# Altium schematic sheet 06.SchDoc
size 513 x 386 mm
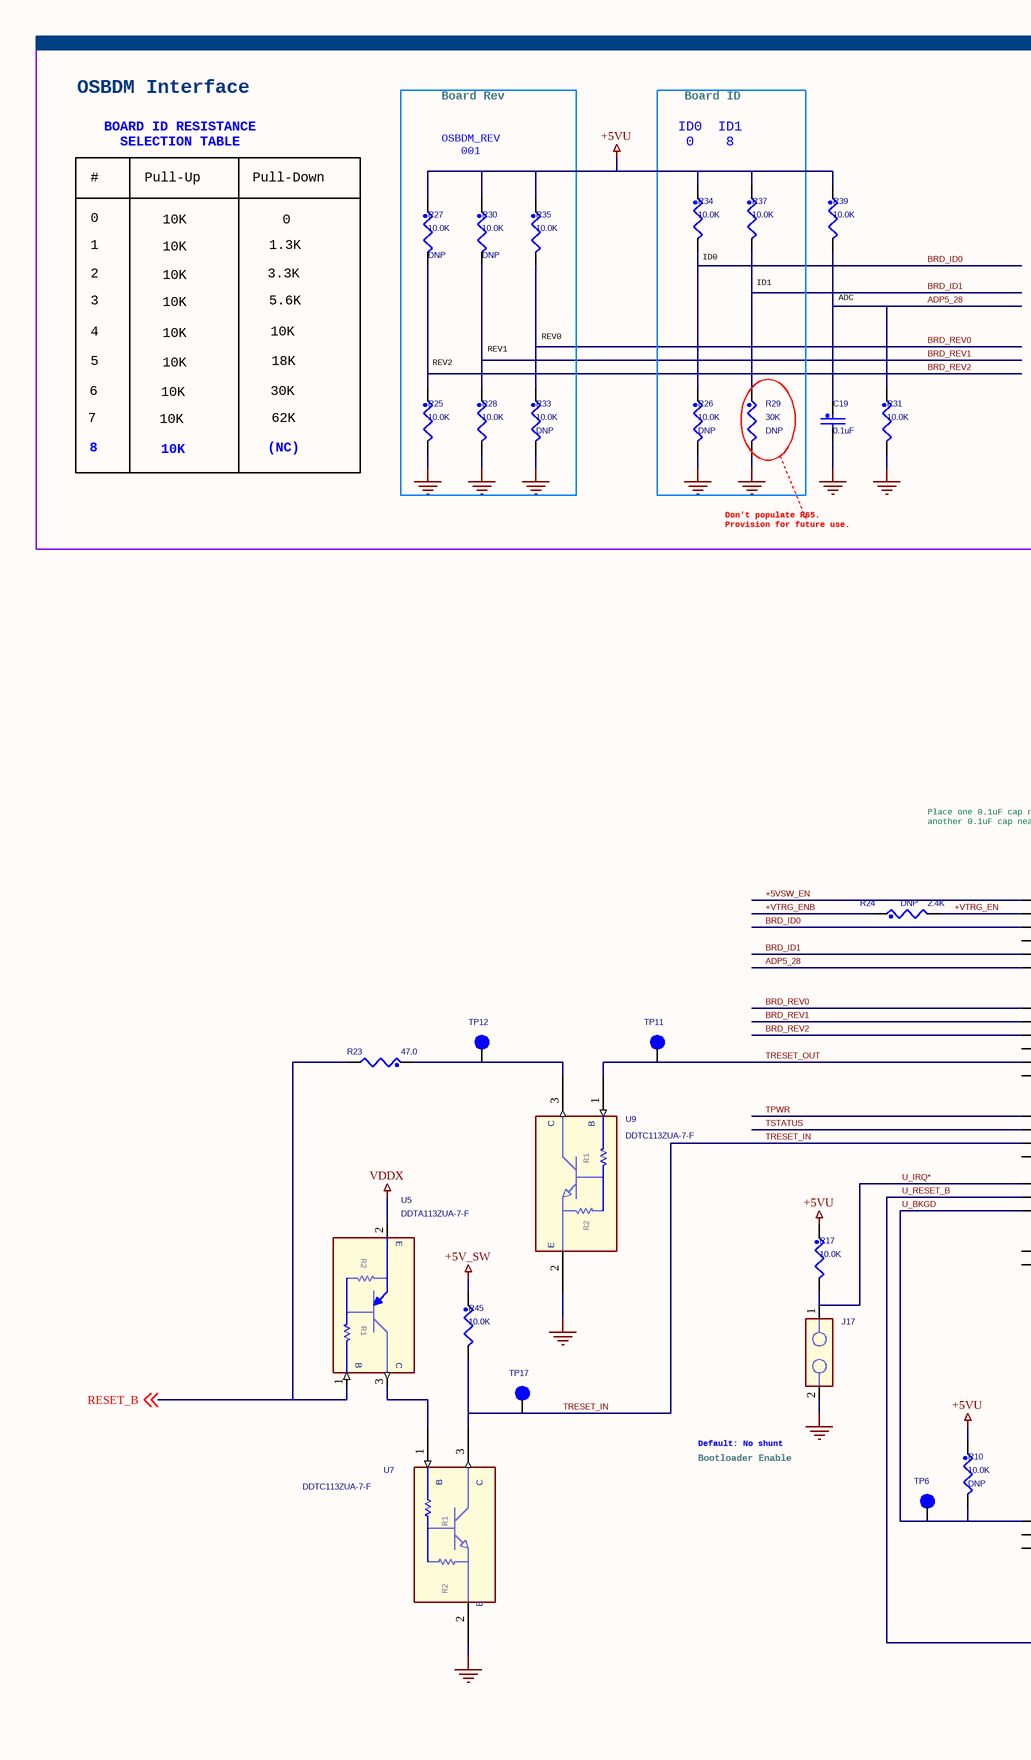
[diagram p0: 06.SchDoc, left]
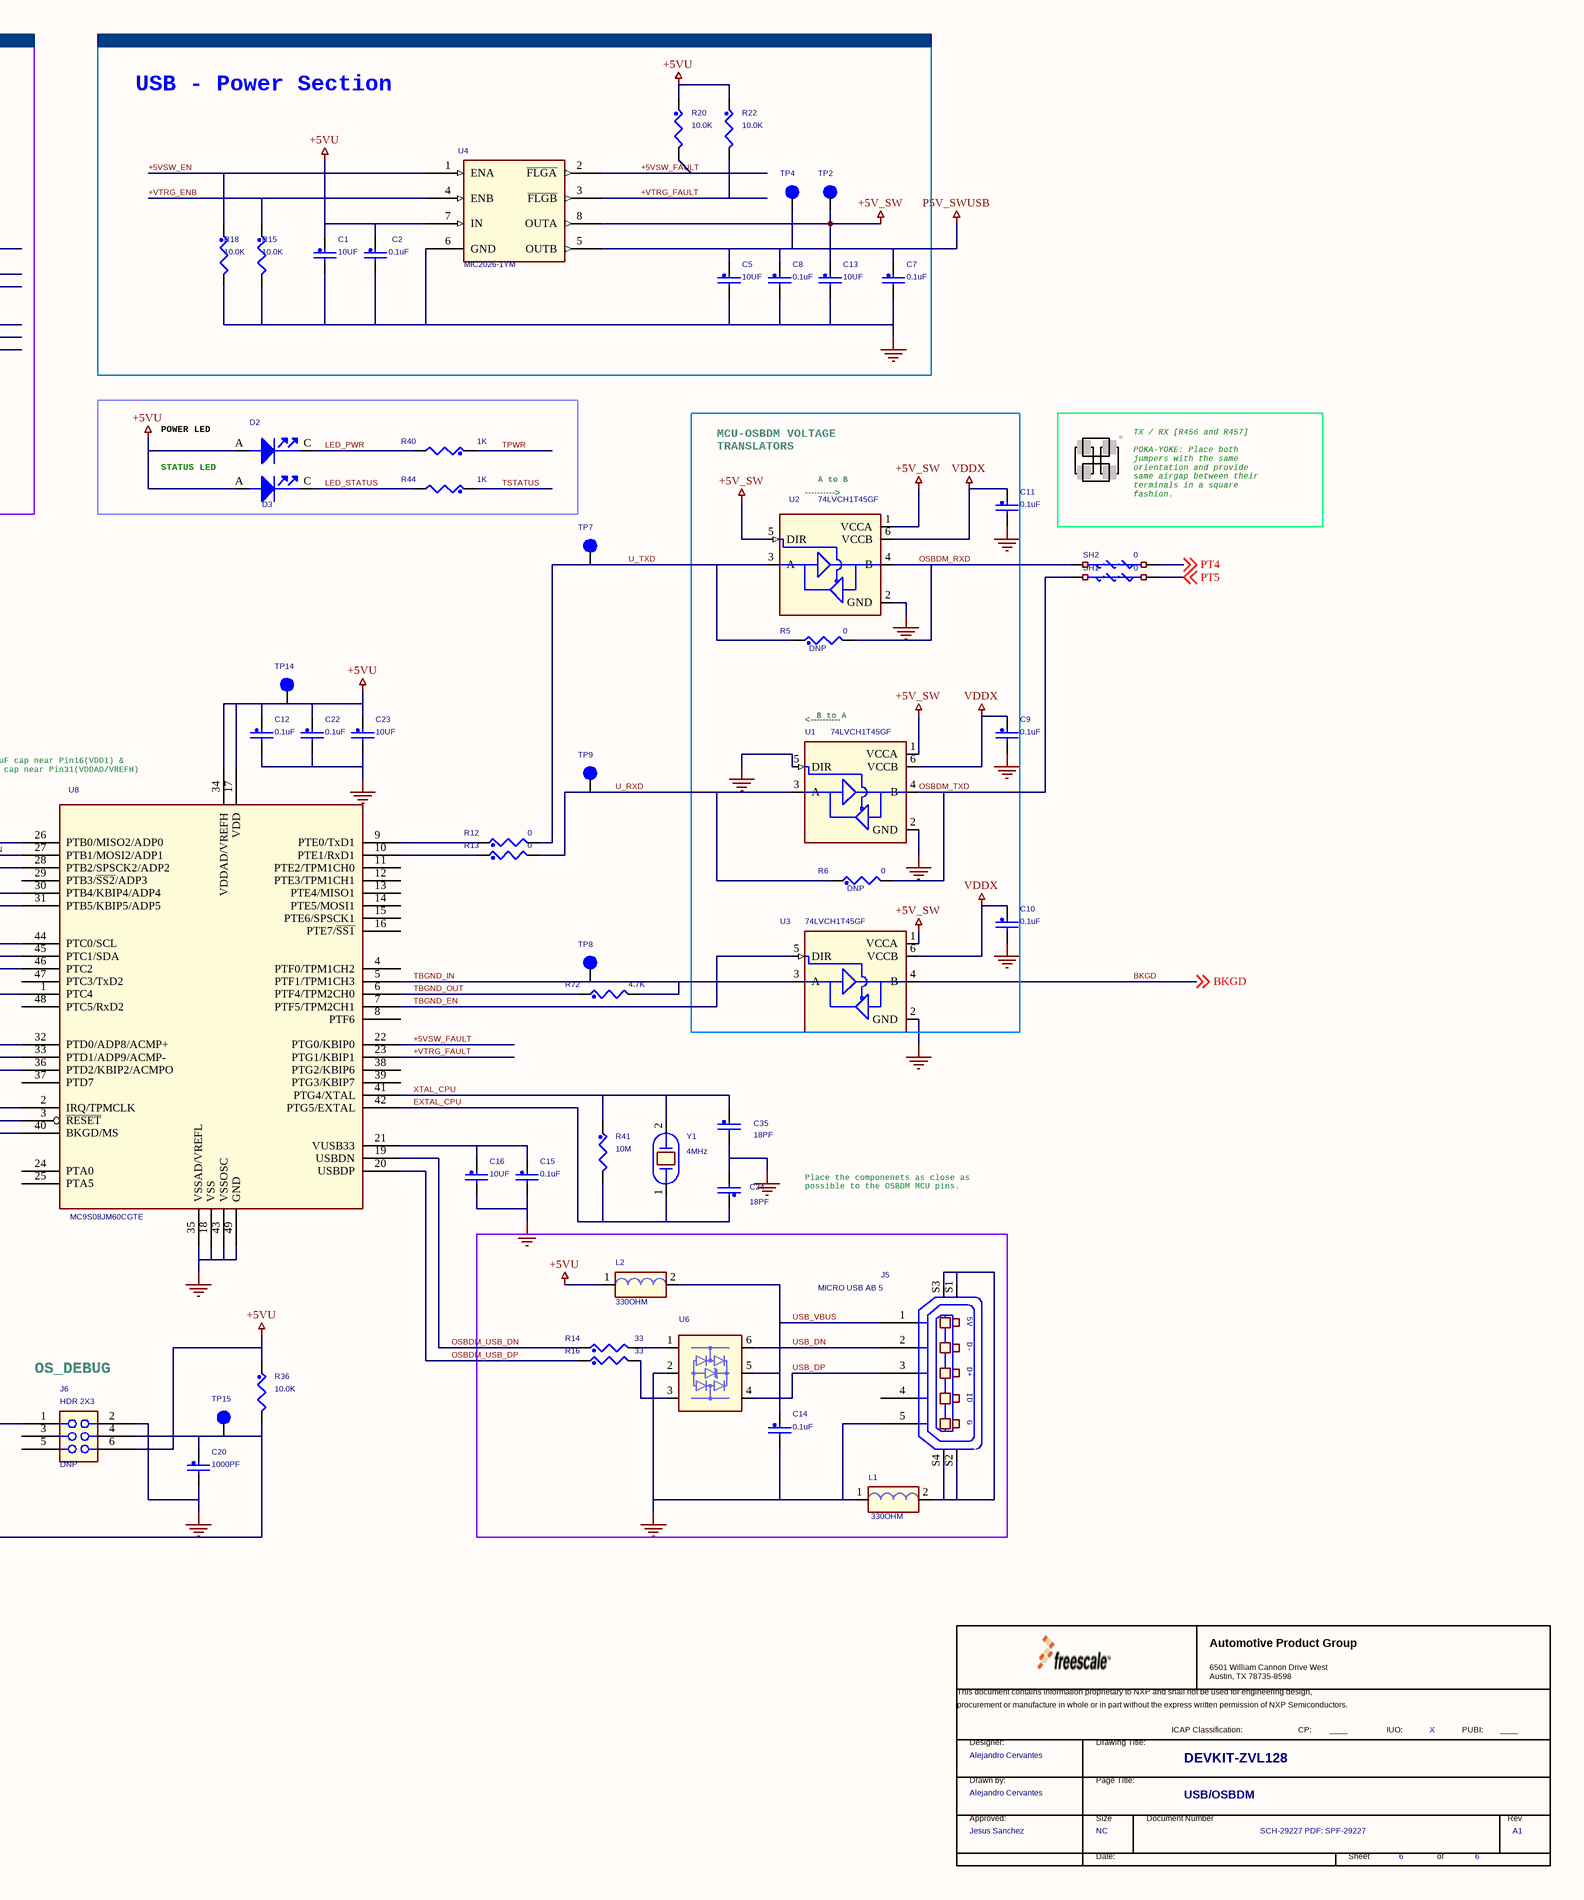
[diagram p1: 06.SchDoc, right]

## Parts
*  FCP: ____  FIUO: X  DrawnBy: Alejandro Cervantes  Approver: Jesus Sanchez  PageTitle: USB/OSBDM  Page Count: 6  Page Size: NC  Title: DEVKIT-ZVL128  RevCode: A1  Doc: SCH-29227 PDF: SPF-29227  (hidden comment: TitleBlock_AMPG)  (graphical)
C1  10UF  [CC0805_OV]
C2  0.1uF  [CC0402_25]
C5  10UF  [CC0805_OV]
C7  0.1uF  [CC0402_25]
C8  0.1uF  [CC0402_25]
C9  0.1uF  [CC0402_25]
C10  0.1uF  [CC0402_25]
C11  0.1uF  [CC0402_25]
C12  0.1uF  [CC0402_25]
C13  10UF  [CC0805_OV]
C14  0.1uF  [CC0402_25]
C15  0.1uF  [CC0402_25]
C16  10UF  [CC0805_OV]
C19  0.1uF  [CC0402_25]
C20  1000PF  [CC0402_25]
C22  0.1uF  [CC0402_25]
C23  10UF  [CC0805_OV]
C24  18PF  [CC0402_25]
C35  18PF  [CC0402_25]
D2  LED_YEL  [LED_0603]  (value not drawn)
D3  LED_GREEN  [LED_0603]  (value not drawn)
J5  MICRO USB AB 5  [con5_microusb]
J6  HDR 2X3  ASSY_OPT: DNP  [HDR203]
J17  HDR 1X2 TH  [HDR102]  (value not drawn)
L1  330OHM  [IND_0805]
L2  330OHM  [IND_0805]
R5  0  ASSY_OPT: DNP  [RC0603_OV]
R6  0  ASSY_OPT: DNP  [RC0603_OV]
R10  10.0K  ASSY_OPT: DNP  [RC0402_25]
R12  0  [RC0603_OV]
R13  0  [RC0603_OV]
R14  33  [RC0603_OV]
R15  10.0K  [RC0402_25]
R16  33  [RC0603_OV]
R17  10.0K  [RC0402_25]
R18  10.0K  [RC0402_25]
R20  10.0K  [RC0402_25]
R22  10.0K  [RC0402_25]
R23  47.0  [RC0603_OV]
R24  2.4K  ASSY_OPT: DNP  [RC0603_OV]
R25  10.0K  [RC0402_25]
R26  10.0K  ASSY_OPT: DNP  [RC0402_25]
R27  10.0K  ASSY_OPT: DNP  [RC0402_25]
R28  10.0K  [RC0402_25]
R29  30K  ASSY_OPT: DNP  [RC0402_25]
R30  10.0K  ASSY_OPT: DNP  [RC0402_25]
R31  10.0K  [RC0402_25]
R33  10.0K  ASSY_OPT: DNP  [RC0402_25]
R34  10.0K  [RC0402_25]
R35  10.0K  [RC0402_25]
R36  10.0K  [RC0402_25]
R37  10.0K  [RC0402_25]
R39  10.0K  [RC0402_25]
R40  1K  [RC0603_OV]
R41  10M  [RC0402_25]
R44  1K  [RC0603_OV]
R45  10.0K  [RC0402_25]
R72  4.7K  [RC0402_25]
SH1  0  [SH0603]
SH2  0  [SH0603]
TP2  TPAD_028  [TPAD_028]  (value not drawn)
TP4  TPAD_028  [TPAD_028]  (value not drawn)
TP6  TPAD_028  [TPAD_028]  (value not drawn)
TP7  TPAD_028  [TPAD_028]  (value not drawn)
TP8  TPAD_028  [TPAD_028]  (value not drawn)
TP9  TPAD_028  [TPAD_028]  (value not drawn)
TP11  TPAD_028  [TPAD_028]  (value not drawn)
TP12  TPAD_028  [TPAD_028]  (value not drawn)
TP14  TPAD_028  [TPAD_028]  (value not drawn)
TP15  TPAD_028  [TPAD_028]  (value not drawn)
TP17  TPAD_028  [TPAD_028]  (value not drawn)
U1  74LVCH1T45GF  [sot891_6p_0p35_1p05x1p05]
U2  74LVCH1T45GF  [sot891_6p_0p35_1p05x1p05]
U3  74LVCH1T45GF  [sot891_6p_0p35_1p05x1p05]
U4  MIC2026-1YM  [SO8]
U5  DDTA113ZUA-7-F  [sc70_3]
U6  RClamp0502A.TCT  [SC-89]  (value not drawn)
U7  DDTC113ZUA-7-F  [sc70_3]
U8  MC9S08JM60CGTE  [qfn48_0p5_5p25x5p25_a]
U9  DDTC113ZUA-7-F  [sc70_3]
Y1  4MHz  [HC49SDLF]

## Blocks framed on the sheet
OSBDM Interface: C19 R31 R39
Board Rev: R25 R27 R28 R30 R33 R35
Board ID: R26 R29 R34 R37
USB - Power Section: C1 C2 C5 C7 C8 C13 R15 R18 R20 R22 TP2 TP4 U4

## Nets
+5V_SW: C13.1 R45.1 TP2.1(Pin1) U1.1(VCCA) U2.1(VCCA) U2.5(DIR) U3.1(VCCA) U4.8(OUTA)
+5VU: C1.1 C2.1 C12.1 C22.1 C23.1 D2.A(ANODE) D3.A(ANODE) J6.6(B3) L2.1 R10.1 R17.1 R20.1 R22.1 R27.1 R30.1 R34.1 R35.1 R36.1 R37.1 R39.1 TP14.1(Pin1) U4.7(IN) U8.17(VDD) U8.34(VDDAD/VREFH)
GND: C1.2 C2.2 C5.2 C7.2 C8.2 C9.2 C10.2 C11.2 C12.2 C13.2 C14.2 C15.2 C16.2 C19.2 C20.2 C22.2 C23.2 C24.2 C35.2 J5.5(P5) J6.2(B1) J17.2 L1.1 R15.2 R18.2 R25.2 R26.2 R28.2 R29.2 R31.2 R33.2 U1.2(GND) U1.5(DIR) U2.2(GND) U3.2(GND) U4.6(GND) U6.2(GND) U7.2(E) U8.18(VSS) U8.35(VSSAD/VREFL) U8.43(VSSOSC) U8.49(GND) U9.2(E)
P5V_SWUSB: C5.1 C7.1 C8.1 TP4.1(Pin1) U4.5(OUTB)
VDDX: C9.1 C10.1 C11.1 U1.6(VCCB) U2.6(VCCB) U3.6(VCCB) U5.2(E)
+5VSW_EN: R18.1 U4.1(ENA) U8.26(PTB0/MISO2/ADP0)
+5VSW_FAULT: R20.2 U4.2(~{FLGA}) U8.22(PTG0/KBIP0)
+VTRG_EN: R24.2 U8.27(PTB1/MOSI2/ADP1)
+VTRG_ENB: R15.1 R24.1 U4.4(ENB)
+VTRG_FAULT: R22.2 U4.3(~{FLGB}) U8.23(PTG1/KBIP1)
ADP5_28: C19.1 R31.1 R39.2 U8.31(PTB5/KBIP5/ADP5)
BKGD: U3.4(B) ; off-sheet BKGD
BRD_ID0: R26.1 R34.2 U8.28(PTB2/SPSCK2/ADP2)
BRD_ID1: R29.1 R37.2 U8.30(PTB4/KBIP4/ADP4)
BRD_REV0: R33.1 R35.2 U8.44(PTC0/SCL)
BRD_REV1: R28.1 R30.2 U8.45(PTC1/SDA)
BRD_REV2: R25.1 R27.2 U8.46(PTC2)
EXTAL_CPU: C24.1 R41.2 U8.42(PTG5/EXTAL) Y1.1
LED_PWR: D2.C(CATHODE) R40.2
LED_STATUS: D3.C(CATHODE) R44.2
OSBDM_RXD: R5.2 SH2.1 U2.4(B)
OSBDM_TXD: R6.2 SH1.1 U1.4(B)
OSBDM_USB_DN: R14.1 U8.19(USBDN)
OSBDM_USB_DP: R16.1 U8.20(USBDP)
PT4: SH2.2 ; off-sheet PT4
PT5: SH1.2 ; off-sheet PT5
RESET_B: R23.2 U5.1(B) ; off-sheet RESET_B
TBGND_EN: U3.5(DIR) U8.7(PTF5/TPM2CH1)
TBGND_IN: R72.2 TP8.1(Pin1) U3.3(A) U8.5(PTF1/TPM1CH3)
TBGND_OUT: R72.1 U8.6(PTF4/TPM2CH0)
TPWR: R40.1 U8.32(PTD0/ADP8/ACMP+)
TRESET_IN: R45.2 TP17.1(Pin1) U7.3(C) U8.36(PTD2/KBIP2/ACMPO)
TRESET_OUT: TP11.1(Pin1) U8.1(PTC4) U9.1(B)
TSTATUS: R44.1 U8.33(PTD1/ADP9/ACMP-)
U_BKGD: J6.1(A1) R10.2 TP6.1(Pin1) U8.40(BKGD/MS)
U_IRQ*: J17.1 R17.2 U8.2(IRQ/TPMCLK)
U_RESET_B: C20.1 J6.4(B2) R36.2 TP15.1(Pin1) U8.3(~{RESET})
U_RXD: R6.1 R13.2 TP9.1(Pin1) U1.3(A)
U_TXD: R5.1 R12.2 TP7.1(Pin1) U2.3(A)
USB_DN: J5.2(P2) U6.6(D+)
USB_DP: J5.3(P3) U6.4(D-)
USB_VBUS: C14.1 J5.1(P1) L2.2 U6.5(VCC)
XTAL_CPU: C35.1 R41.1 U8.41(PTG4/XTAL) Y1.2
NetC15_1: C15.1 C16.1 U8.21(VUSB33)
NetJ5_S1: J5.S1(SHLD1) J5.S2(SHLD2) J5.S3(SHLD3) J5.S4(SHLD4) L1.2
NetR12_1: R12.1 U8.9(PTE0/TxD1)
NetR13_1: R13.1 U8.10(PTE1/RxD1)
NetR14_2: R14.2 U6.1(D+_PC)
NetR16_2: R16.2 U6.3(D-_PC)
NetR23_1: R23.1 TP12.1(Pin1) U9.3(C)
NetU5_3: U5.3(C) U7.1(B)

Not connected (* = marked no-connect by the designer): J5 4(P4); J6 3(A2) 5(A3); U8 4(PTF0/TPM1CH2) 8(PTF6) 11(PTE2/TPM1CH0) 12(PTE3/TPM1CH1) 13(PTE4/MISO1) 14(PTE5/MOSI1) 15(PTE6/SPSCK1) 16(PTE7/~{SS1}) 24(PTA0) 25(PTA5) 29(PTB3/~{SS2}/ADP3) 37(PTD7) 38(PTG2/KBIP6) 39(PTG3/KBIP7) 47(PTC3/TxD2) 48(PTC5/RxD2)

## Notes on the sheet
- BOARD ID RESISTANCE
  SELECTION TABLE
- OSBDM_REV
  001
- ID0  ID1
  0    8
- #
- Pull-Up
- Pull-Down
- 1
- 2
- 0
- 10K
- 3.3K
- 1.3K
- (near R34) ID0
- 3
- 4
- 5.6K
- REV0
- (near R37) ID1
- ADC
- 6
- 5
- 30K
- 18K
- REV2
- REV1
- 7
- 8
- (NC)
- 62K
- POWER LED
- MCU-OSBDM VOLTAGE
  TRANSLATORS
- TX / RX [R456 and R457]
  POKA-YOKE: Place both
  jumpers with the same
  orientation and provide
  same airgap between their
  terminals in a square
  fashion.
- Don't populate R65.
  Provision for future use.
- STATUS LED
- (near U2) ---------->
- (near U2) A to B
- (near U8) Place one 0.1uF cap near Pin16(VDD1) &
  another 0.1uF cap near Pin31(VDDAD/VREFH)
- (near U1) <----------
- (near U1) B to A
- Place the componenets as close as
  possible to the OSBDM MCU pins.
- Default: No shunt
- Bootloader Enable
- OS_DEBUG
- (in symbol DDTA113ZCA_3P) R2; R1
- (in symbol DDTD122LC) R1; R2
- (in symbol TitleBlock_AMPG) Automotive Product Group; 6501 William Cannon Drive West / Austin, TX 78735-8598; This document contains information proprietary to NXP and shall not be used for engineering design,; procurement or manufacture in whole or in part without the express written permission of NXP Semiconductors.; ICAP Classification:; CP:; IUO:; PUBI:; Designer:; Drawing Title:; Drawn by:; Page Title:; Approved:; Size; Document Number; Rev; Date:; Sheet; of
- (in symbol USB_MINI_AB_RECEPTACLE) 5V; D-; D+; ID; G

## Library data of the parts
* = TitleBlock_AMPG: OrgAddr2: Austin, TX 78735-8598; OrgAddr1: 6501 William Cannon Drive West; OrgName: Freescale Semiconductor; PUBI: ____; Designer: Alejandro Cervantes; Page Number: 6; Page Create Date: March  8, 1995
C1 C16 = CAP_NP: CAP CER 10UF 10V 10% X7R 0805; CLASS: DISCRETE; FPLIST: CC0805_OV,CC0805,0805_CC; CAD_APPROVED: Yes; MFG_PN01: GRM21BR71A106KE51L; MFG_NAME01: Murata; AGILE_PN: 150-78501; VOLTAGE: 10V; HEIGHT: 1.4MM; ROHS: Yes; Tolerance: 10%
C2 C7 C8 C15 C22 = CAP_NP: CAP CER 0.1uF 50V 10% X7R 0402; CLASS: DISCRETE; FPLIST: CC0402_25,CC0402_HD,0402_CC; CAD_APPROVED: Yes; MFG_PN01: GRM155R71H104KE14D; MFG_NAME01: MURATA; AGILE_PN: 150-79069; HEIGHT: 0.55MM; ROHS: Yes; Tolerance: 10%; TOL: 10%; VOLTAGE: 50V
C5 C13 C23 = CAP_NP: CAP CER 10UF 10V 10% X7R 0805; CLASS: DISCRETE; AGILE_PN: 150-78501; MFG_NAME01: Murata; MFG_PN01: GRM21BR71A106KE51L; CAD_APPROVED: Yes; FPLIST: CC0805_OV,CC0805,0805_CC; Tolerance: 10%; ROHS: Yes; HEIGHT: 1.4MM; VOLTAGE: 10V
C9-C12 C14 C19 = CAP_NP: CAP CER 0.1uF 50V 10% X7R 0402; CLASS: DISCRETE; AGILE_PN: 150-79069; MFG_NAME01: MURATA; MFG_PN01: GRM155R71H104KE14D; CAD_APPROVED: Yes; FPLIST: CC0402_25,CC0402_HD,0402_CC; VOLTAGE: 50V; Tolerance: 10%; ROHS: Yes; HEIGHT: 0.55MM
  C12 C14 C19: TOL: 10%
C20 = CAP_NP: CAP CER 1000PF 50V 10% X7R 0402; CLASS: DISCRETE; VOLTAGE: 50VDC; TOL: 5%; FPLIST: CC0402_25,CC0402_HD,0402_CC; CAD_APPROVED: Yes; MFG_PN01: 04025C102KAT2A; MFG_NAME01: AVX; Tolerance: +10%; AGILE_PN: 150-75271; HEIGHT: 0.635 MM; ROHS: Yes
C24 C35 = CAP_NP: CAP CER 18PF 50V 1% C0G 0402; CLASS: DISCRETE; FPLIST: CC0402_25,CC0402_HD,0402_CC; CAD_APPROVED: Yes; MFG_PN01: 04025A180FAT2A; MFG_NAME01: AVX; AGILE_PN: 150-76630; VOLTAGE: 50V; HEIGHT: 0.59MM; ROHS: Yes; Tolerance: 1%
D2 = LED: LED YEL SGL 25MA 0603; CLASS: IC; CAD_APPROVED: Yes; MFG_PN01: 598-8040-107F; MFG_NAME01: DIALIGHT; AGILE_PN: 370-76522; HEIGHT: 0.8MM; ROHS: Yes
D3 = LED: LED ULTRA-BRIGHT GREEN SMT 0603; CLASS: IC; AGILE_PN: 370-75077; MFG_NAME01: LITE ON; MFG_PN01: LTST-C190KGKT; CAD_APPROVED: YES; ROHS: Yes; HEIGHT: 0.8MM
J5 = USB_MINI_AB_RECEPTACLE: CON 1X5 USB_MICRO_AB_RECEPTACLE RA SMT 0.65MM SP 105H AU; CLASS: IO; AGILE_PN: 211-78722; MFG_NAME01: Molex; MFG_PN01: 47589-0001; CAD_APPROVED: Yes; ROHS: Yes; HEIGHT: 2.65MM
J6 = CONN_HDR_3X2: HDR 2X3 TH 100MIL CTR 335H AU 95L; CLASS: IO; CAD_APPROVED: Yes; MFG_PN01: TSW-103-07-S-D; MFG_NAME01: SAMTEC; AGILE_PN: 210-75698; PRIORITY_PN: 028-00560; VOLTAGE: 450-550VAC; HEIGHT: 8.5MM; ROHS: Yes
J17 = JUMPER_0: HDR 1X2 TH 100MIL SP 339H AU 98L; CLASS: IO; CAD_APPROVED: YES; MFG_PN01: TSW-102-07-G-S; MFG_NAME01: SAMTEC; AGILE_PN: 210-80468; PRIORITY_PN: 028-00556; HEIGHT: 8.71 MM; ROHS: Yes
L1 = BEAD: IND FER BEAD 330 OHM@100MHZ 1.5A 25% 0805; PART_TYPE: FERRITE\BEAD; CLASS: DISCRETE; PRIORITY_PN: 024-00202; CAD_APPROVED: Yes; MFG_PN01: BLM21PG331SN1D; MFG_NAME01: MURATA; AGILE_PN: 180-77691; HEIGHT: 1.05MM; ROHS: Yes; Tolerance: 25%; TOL: 25%
L2 = BEAD: IND FER BEAD 330 OHM@100MHZ 1.5A 25% 0805; PART_TYPE: FERRITE\BEAD; CLASS: DISCRETE; AGILE_PN: 180-77691; MFG_NAME01: MURATA; MFG_PN01: BLM21PG331SN1D; CAD_APPROVED: Yes; PRIORITY_PN: 024-00202; TOL: 25%; Tolerance: 25%; ROHS: Yes; HEIGHT: 1.05MM
R5 = RES: RES MF ZERO OHM 1/10W -- AEC-Q200 0603; CLASS: DISCRETE; AGILE_PN: 470-75407; Tolerance: 1%; MFG_NAME01: KOA SPEER; MFG_PN01: RK73Z1JTTD; CAD_APPROVED: Yes; FPLIST: RC0603_OV,RC0603,R603-X2,0603_CC; PRIORITY_PN: 006-00371; ROHS: Yes; VOLTAGE: 1/10W; HEIGHT: 0.6MM
R6 R12 R13 = RES: RES MF ZERO OHM 1/10W -- AEC-Q200 0603; CLASS: DISCRETE; PRIORITY_PN: 006-00371; AGILE_PN: 470-75407; Tolerance: 1%; MFG_NAME01: KOA SPEER; MFG_PN01: RK73Z1JTTD; CAD_APPROVED: Yes; FPLIST: RC0603_OV,RC0603,R603-X2,0603_CC; VOLTAGE: 1/10W; ROHS: Yes; HEIGHT: 0.6MM
R10 R17 R25-R28 R30 R31 R33-R37 R39 R45 = RES: RES MF 10.0K 1/16W 1% AEC-Q200 0402; CLASS: DISCRETE; AGILE_PN: 470-75416; MFG_NAME01: KOA SPEER; MFG_PN01: RK73H1ETTP1002F; CAD_APPROVED: Yes; FPLIST: RC0402_25,RC0402_HD,0402_CC; Tolerance: 1%; ROHS: Yes; HEIGHT: 0.4MM
R14 = RES: RES MF 33 OHM 1/10W 5% AEC-Q200 0603; CLASS: DISCRETE; FPLIST: RC0603_OV,RC0603,0603_CC; CAD_APPROVED: Yes; MFG_PN01: CRCW060333R0JNEA; MFG_NAME01: VISHAY INTERTECHNOLOGY; AGILE_PN: 470-75848; ROHS: Yes; Tolerance: 5%; TOL: 5%; HEIGHT: 0.55 MM
R15 R18 = RES: RES MF 10.0K 1/16W 1% AEC-Q200 0402; CLASS: DISCRETE; FPLIST: RC0402_25,RC0402_HD,0402_CC; CAD_APPROVED: Yes; MFG_PN01: RK73H1ETTP1002F; MFG_NAME01: KOA SPEER; AGILE_PN: 470-75416; HEIGHT: 0.4MM; ROHS: Yes; Tolerance: 1%
R16 = RES: RES MF 33 OHM 1/10W 5% AEC-Q200 0603; CLASS: DISCRETE; AGILE_PN: 470-75848; MFG_NAME01: VISHAY INTERTECHNOLOGY; MFG_PN01: CRCW060333R0JNEA; CAD_APPROVED: Yes; FPLIST: RC0603_OV,RC0603,0603_CC; HEIGHT: 0.55 MM; TOL: 5%; Tolerance: 5%; ROHS: Yes
R20 = RES: RES MF 10.0K 1/16W 1% AEC-Q200 0402; CLASS: DISCRETE; FPLIST: RC0402_25,RC0402_HD,0402_CC; CAD_APPROVED: Yes; ASSY_OPT: DNP; MFG_PN01: RK73H1ETTP1002F; MFG_NAME01: KOA SPEER; AGILE_PN: 470-75416; HEIGHT: 0.4MM; ROHS: Yes; Tolerance: 1%
R22 = RES: RES MF 10.0K 1/16W 1% AEC-Q200 0402; CLASS: DISCRETE; AGILE_PN: 470-75416; MFG_NAME01: KOA SPEER; MFG_PN01: RK73H1ETTP1002F; ASSY_OPT: DNP; CAD_APPROVED: Yes; FPLIST: RC0402_25,RC0402_HD,0402_CC; Tolerance: 1%; ROHS: Yes; HEIGHT: 0.4MM
R23 = RES: RES MF 47.0 OHM 1/10W 1% 0603; CLASS: DISCRETE; FPLIST: RC0603_OV,RC0603,0603_CC; CAD_APPROVED: Yes; MFG_PN01: RK73H1JTTD47R0F; MFG_NAME01: KOA SPEER; AGILE_PN: 470-75816; PRIORITY_PN: 006-00488; ROHS: Yes; Tolerance: 1%; TOL: 1%; HEIGHT: 0.55 MM
R24 = RES: RES MF 2.40K 1/10W 1% 0603; CLASS: DISCRETE; FPLIST: RC0603_OV,RC0603,0603_CC; CAD_APPROVED: Yes; MFG_PN01: RK73H1JTTD2401F; MFG_NAME01: KOA SPEER; AGILE_PN: 470-30476; PRIORITY_PN: 006-01136; ROHS: Yes; Tolerance: 1%; TOL: 1%; HEIGHT: 0.55 MM
R29 = RES: RES MF 30K  1/16W 1% 0402; CLASS: DISCRETE; FPLIST: RC0402_25,RC0402_HD,0402_CC; CAD_APPROVED: Yes; MFG_PN01: RK73H1ETTP3002F; MFG_NAME01: KOA SPEER; AGILE_PN: 470-30999; HEIGHT: 0.40 MM; ROHS: Yes; Tolerance: 1%
R40 = RES: RES MF 1.0K 1/10W 5% 0603; CLASS: DISCRETE; FPLIST: RC0603_OV,RC0603,0603_CC; CAD_APPROVED: YES; MFG_PN01: CR0603-10W-102JT; MFG_NAME01: VENKEL COMPANY; AGILE_PN: 470-75412; HEIGHT: 0.6MM; TOL: 5%; ROHS: Yes; Tolerance: 5%
R41 = RES: RES MF 10M  1/16W 1% 0402; CLASS: DISCRETE; FPLIST: RC0402_25,RC0402_HD,0402_CC; CAD_APPROVED: Yes; MFG_PN01: RK73H1ETTP1005F; MFG_NAME01: KOA SPEER; AGILE_PN: 470-31288; ROHS: Yes; Tolerance: 1%; HEIGHT: 0.40 MM
R44 = RES: RES MF 1.0K 1/10W 5% 0603; CLASS: DISCRETE; AGILE_PN: 470-75412; MFG_NAME01: VENKEL COMPANY; MFG_PN01: CR0603-10W-102JT; CAD_APPROVED: YES; FPLIST: RC0603_OV,RC0603,0603_CC; HEIGHT: 0.6MM; TOL: 5%; Tolerance: 5%; ROHS: Yes
R72 = RES: RES MF 4.7K 1/16W 5% 0402; CLASS: DISCRETE; FPLIST: RC0402_25,RC0402_HD,0402_CC; CAD_APPROVED: Yes; MFG_PN01: RK73B1ETTP472J; MFG_NAME01: KOA SPEER; AGILE_PN: 470-75626; HEIGHT: 0.41mm; ROHS: Yes; Tolerance: 5%
SH1 SH2 = RES_SHORT-2: ZERO OHM CUT TRACE 0603 PADS; NO PART TO ORDER; CLASS: DISCRETE; AGILE_PN: 470-80018; MFG_NAME01: LAYOUT ELEMENT ONLY; CAD_APPROVED: Yes; FPLIST: SH0603,SH0603_CC,SH0603-X2_PIN1TO2,SH0603-X2_PIN2TO3; MFG_PN01: LAYOUT ELEMENT ONLY; ROHS: Yes; HEIGHT: 0.1MM
TP2 TP4 = TestLoop: TEST POINT PAD 28MIL DIA SMT, NO PART TO ORDER; CLASS: IO; CAD_APPROVED: Yes; AGILE_PN: 211-79313; HEIGHT: 0.1 MM; ROHS: Yes; MFG_PN01: N/A; MFG_NAME01: N/A
TP6-TP9 TP11 TP12 TP14 TP15 TP17 = TestLoop: TEST POINT PAD 28MIL DIA SMT, NO PART TO ORDER; CLASS: IO; AGILE_PN: 211-79313; CAD_APPROVED: Yes; MFG_NAME01: N/A; MFG_PN01: N/A; ROHS: Yes; HEIGHT: 0.1 MM
U1 U2 = 74LVCH1T45_0: IC XCVR 1BIT 3-STATE DUAL 1.2-5.5V SOT891; AGILE_PN: 312-80895; MFG_NAME01: NXP Semiconductors; MFG_PN01: 74LVCH1T45GF,132; CAD_APPROVED: Yes; CLASS: IC; ROHS: Yes; HEIGHT: 0.5MM
U3 = 74LVCH1T45_0: IC XCVR 1BIT 3-STATE DUAL 1.2-5.5V SOT891; CAD_APPROVED: Yes; MFG_PN01: 74LVCH1T45GF,132; MFG_NAME01: NXP Semiconductors; AGILE_PN: 312-80895; CLASS: IC; HEIGHT: 0.5MM; ROHS: Yes
U4 = MIC2526_8P: IC LIN SW PWR ACTIVE HIGH DUAL 2.7V-5.5V 0.5A SOIC8; CAD_APPROVED: Yes; MFG_NAME01: MICREL; AGILE_PN: 312-75936; PRIORITY_PN: 051-MIC20261YM; VOLTAGE: 2.7-5.5V; CLASS: IC; HEIGHT: 1.73mm; ROHS: Yes; MFG_PN01: MIC2026-1YM
U5 = DDTA113ZCA_3P: TRAN PNP PRE-BIASED 100MA 50V SOT-323; CLASS: IC; CAD_APPROVED: Yes; MFG_NAME01: DIODES INC; AGILE_PN: 480-78942; HEIGHT: 1.1MM; ROHS: Yes; MFG_PN01: DDTA113ZUA-7-F
U6 = RClamp0502A_6P: IC TVS ARRAY LOW CAP 3A 5V SOT666; CAD_APPROVED: Yes; MFG_NAME01: SEMTECH CORP; AGILE_PN: 312-80272; CLASS: IC; HEIGHT: 0.6MM; ROHS: Yes; MFG_PN01: RClamp0502A.TCT
U7 U9 = DDTD122LC: TRAN NPN PRE-BIASED 100MA 50V SOT-323; CLASS: IC; AGILE_PN: 480-78940; MFG_NAME01: DIODES INC; CAD_APPROVED: Yes; MFG_PN01: DDTC113ZUA-7-F; ROHS: Yes; HEIGHT: 1.1MM
U8 = MC9S08JM60CGT_4: IC MCU 8BIT 48MHZ 60KB FLASH 2.7-5.5V QFN48; AGILE_PN: 312-78039; MFG_NAME01: FREESCALE SEMICONDUCTOR; CAD_APPROVED: Yes; CLASS: IC; MFG_PN01: MC9S08JM60CGTE; ROHS: Yes; HEIGHT: 1.00MM
Y1 = XTAL: XTAL 4MHZ -- 18PF 20PPM SMT; CLASS: IC; CAD_APPROVED: Yes; MFG_PN01: ABLS-4.000MHZ-B2-T; MFG_NAME01: ABRACON CORP; AGILE_PN: 230-77689; PRIORITY_PN: 048-00299; HEIGHT: 4.2MM; ROHS: Yes